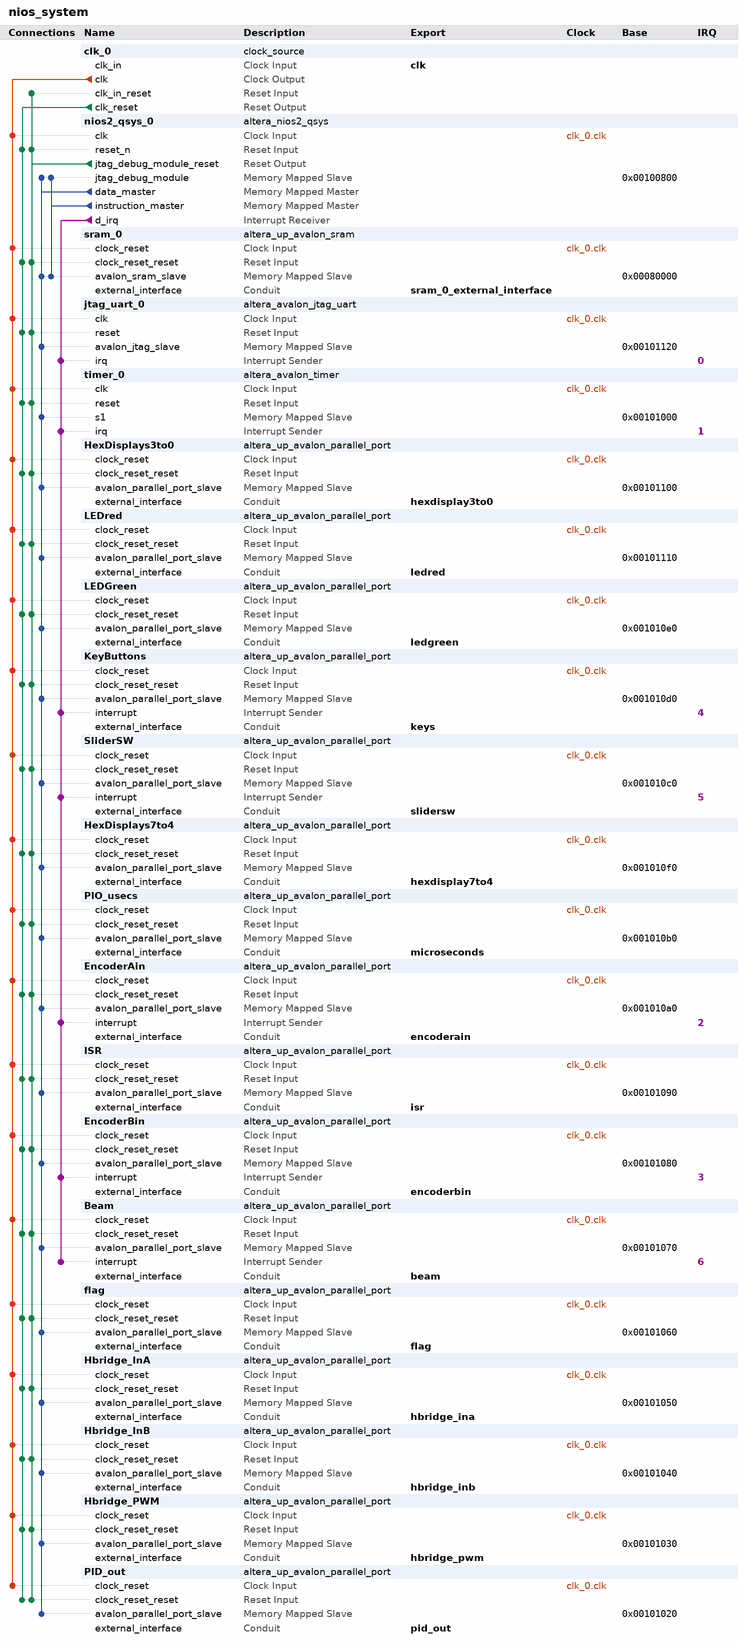
[diagram p0: system contents]
# Platform Designer (Qsys) system nios_system, Cyclone II EP2C35F672C6
# Parameters at their usual value, and those the tool derives, are not listed.
package require -exact qsys 13.0
create_system nios_system
set_project_property DEVICE_FAMILY {Cyclone II}
set_project_property DEVICE EP2C35F672C6

add_instance clk_0 clock_source 13.0
set_instance_parameter_value clk_0 clockFrequency 50000000

add_instance nios2_qsys_0 altera_nios2_qsys 13.0
set_instance_parameter_value nios2_qsys_0 resetSlave sram_0.avalon_sram_slave
set_instance_parameter_value nios2_qsys_0 mmu_TLBMissExcSlave None
set_instance_parameter_value nios2_qsys_0 exceptionSlave sram_0.avalon_sram_slave
set_instance_parameter_value nios2_qsys_0 breakSlave nios2_qsys_0.jtag_debug_module
set_instance_parameter_value nios2_qsys_0 impl Small
set_instance_parameter_value nios2_qsys_0 icache_size 4096

add_instance sram_0 altera_up_avalon_sram 13.0
set_instance_parameter_value sram_0 board DE2
set_instance_parameter_value sram_0 pixel_buffer false

add_instance jtag_uart_0 altera_avalon_jtag_uart 13.0.1.99.2
set_instance_parameter_value jtag_uart_0 simInteractiveOptions NO_INTERACTIVE_WINDOWS

add_instance timer_0 altera_avalon_timer 13.0.1.99.2
set_instance_parameter_value timer_0 period 1
set_instance_parameter_value timer_0 periodUnits MSEC

add_instance HexDisplays3to0 altera_up_avalon_parallel_port 13.0
set_instance_parameter_value HexDisplays3to0 board DE2
set_instance_parameter_value HexDisplays3to0 preset {Seven Segment Displays}
set_instance_parameter_value HexDisplays3to0 capture false
set_instance_parameter_value HexDisplays3to0 edge Rising
set_instance_parameter_value HexDisplays3to0 irq false

add_instance LEDred altera_up_avalon_parallel_port 13.0
set_instance_parameter_value LEDred board DE2
set_instance_parameter_value LEDred preset LEDs
set_instance_parameter_value LEDred leds Red
set_instance_parameter_value LEDred capture false
set_instance_parameter_value LEDred edge Rising
set_instance_parameter_value LEDred irq false

add_instance LEDGreen altera_up_avalon_parallel_port 13.0
set_instance_parameter_value LEDGreen board DE2
set_instance_parameter_value LEDGreen preset LEDs
set_instance_parameter_value LEDGreen capture false
set_instance_parameter_value LEDGreen edge Rising
set_instance_parameter_value LEDGreen irq false

add_instance KeyButtons altera_up_avalon_parallel_port 13.0
set_instance_parameter_value KeyButtons board DE2
set_instance_parameter_value KeyButtons preset Pushbuttons
set_instance_parameter_value KeyButtons capture true
set_instance_parameter_value KeyButtons edge Rising
set_instance_parameter_value KeyButtons irq true

add_instance SliderSW altera_up_avalon_parallel_port 13.0
set_instance_parameter_value SliderSW board DE2
set_instance_parameter_value SliderSW preset {Slider Switches}
set_instance_parameter_value SliderSW capture true
set_instance_parameter_value SliderSW edge Either
set_instance_parameter_value SliderSW irq true

add_instance HexDisplays7to4 altera_up_avalon_parallel_port 13.0
set_instance_parameter_value HexDisplays7to4 board DE2
set_instance_parameter_value HexDisplays7to4 preset {Seven Segment Displays}
set_instance_parameter_value HexDisplays7to4 sevensegs {7 to 4}
set_instance_parameter_value HexDisplays7to4 capture false
set_instance_parameter_value HexDisplays7to4 edge Rising
set_instance_parameter_value HexDisplays7to4 irq false

add_instance PIO_usecs altera_up_avalon_parallel_port 13.0
set_instance_parameter_value PIO_usecs board DE2
set_instance_parameter_value PIO_usecs custom_port true
set_instance_parameter_value PIO_usecs preset Pushbuttons
set_instance_parameter_value PIO_usecs capture true
set_instance_parameter_value PIO_usecs edge Rising
set_instance_parameter_value PIO_usecs irq false

add_instance EncoderAin altera_up_avalon_parallel_port 13.0
set_instance_parameter_value EncoderAin board DE2
set_instance_parameter_value EncoderAin custom_port true
set_instance_parameter_value EncoderAin preset Pushbuttons
set_instance_parameter_value EncoderAin capture true
set_instance_parameter_value EncoderAin edge Either
set_instance_parameter_value EncoderAin irq true

add_instance ISR altera_up_avalon_parallel_port 13.0
set_instance_parameter_value ISR board DE2
set_instance_parameter_value ISR custom_port true
set_instance_parameter_value ISR preset Pushbuttons
set_instance_parameter_value ISR capture false
set_instance_parameter_value ISR edge Rising
set_instance_parameter_value ISR irq false

add_instance EncoderBin altera_up_avalon_parallel_port 13.0
set_instance_parameter_value EncoderBin board DE2
set_instance_parameter_value EncoderBin custom_port true
set_instance_parameter_value EncoderBin preset Pushbuttons
set_instance_parameter_value EncoderBin capture true
set_instance_parameter_value EncoderBin edge Either
set_instance_parameter_value EncoderBin irq true

add_instance Beam altera_up_avalon_parallel_port 13.0
set_instance_parameter_value Beam board DE2
set_instance_parameter_value Beam custom_port true
set_instance_parameter_value Beam preset Pushbuttons
set_instance_parameter_value Beam capture true
set_instance_parameter_value Beam edge Either
set_instance_parameter_value Beam irq true

add_instance flag altera_up_avalon_parallel_port 13.0
set_instance_parameter_value flag board DE2
set_instance_parameter_value flag custom_port true
set_instance_parameter_value flag preset Pushbuttons
set_instance_parameter_value flag capture true
set_instance_parameter_value flag edge Either
set_instance_parameter_value flag irq true

add_instance Hbridge_InA altera_up_avalon_parallel_port 13.0
set_instance_parameter_value Hbridge_InA board DE2
set_instance_parameter_value Hbridge_InA custom_port true
set_instance_parameter_value Hbridge_InA preset Pushbuttons
set_instance_parameter_value Hbridge_InA capture false
set_instance_parameter_value Hbridge_InA edge Rising
set_instance_parameter_value Hbridge_InA irq false

add_instance Hbridge_InB altera_up_avalon_parallel_port 13.0
set_instance_parameter_value Hbridge_InB board DE2
set_instance_parameter_value Hbridge_InB custom_port true
set_instance_parameter_value Hbridge_InB preset Pushbuttons
set_instance_parameter_value Hbridge_InB capture false
set_instance_parameter_value Hbridge_InB edge Rising
set_instance_parameter_value Hbridge_InB irq false

add_instance Hbridge_PWM altera_up_avalon_parallel_port 13.0
set_instance_parameter_value Hbridge_PWM board DE2
set_instance_parameter_value Hbridge_PWM custom_port true
set_instance_parameter_value Hbridge_PWM preset Pushbuttons
set_instance_parameter_value Hbridge_PWM capture false
set_instance_parameter_value Hbridge_PWM edge Rising
set_instance_parameter_value Hbridge_PWM irq false

add_instance PID_out altera_up_avalon_parallel_port 13.0
set_instance_parameter_value PID_out board DE2
set_instance_parameter_value PID_out custom_port true
set_instance_parameter_value PID_out preset Pushbuttons
set_instance_parameter_value PID_out capture true
set_instance_parameter_value PID_out edge Either
set_instance_parameter_value PID_out irq true

# connections
add_connection clk_0.clk Beam.clock_reset clock
add_connection clk_0.clk EncoderAin.clock_reset clock
add_connection clk_0.clk EncoderBin.clock_reset clock
add_connection clk_0.clk flag.clock_reset clock
add_connection clk_0.clk Hbridge_InA.clock_reset clock
add_connection clk_0.clk Hbridge_InB.clock_reset clock
add_connection clk_0.clk Hbridge_PWM.clock_reset clock
add_connection clk_0.clk HexDisplays3to0.clock_reset clock
add_connection clk_0.clk HexDisplays7to4.clock_reset clock
add_connection clk_0.clk ISR.clock_reset clock
add_connection clk_0.clk jtag_uart_0.clk clock
add_connection clk_0.clk KeyButtons.clock_reset clock
add_connection clk_0.clk LEDGreen.clock_reset clock
add_connection clk_0.clk LEDred.clock_reset clock
add_connection clk_0.clk nios2_qsys_0.clk clock
add_connection clk_0.clk PID_out.clock_reset clock
add_connection clk_0.clk PIO_usecs.clock_reset clock
add_connection clk_0.clk SliderSW.clock_reset clock
add_connection clk_0.clk sram_0.clock_reset clock
add_connection clk_0.clk timer_0.clk clock
add_connection clk_0.clk_reset Beam.clock_reset_reset reset
add_connection clk_0.clk_reset EncoderAin.clock_reset_reset reset
add_connection clk_0.clk_reset EncoderBin.clock_reset_reset reset
add_connection clk_0.clk_reset flag.clock_reset_reset reset
add_connection clk_0.clk_reset Hbridge_InA.clock_reset_reset reset
add_connection clk_0.clk_reset Hbridge_InB.clock_reset_reset reset
add_connection clk_0.clk_reset Hbridge_PWM.clock_reset_reset reset
add_connection clk_0.clk_reset HexDisplays3to0.clock_reset_reset reset
add_connection clk_0.clk_reset HexDisplays7to4.clock_reset_reset reset
add_connection clk_0.clk_reset ISR.clock_reset_reset reset
add_connection clk_0.clk_reset jtag_uart_0.reset reset
add_connection clk_0.clk_reset KeyButtons.clock_reset_reset reset
add_connection clk_0.clk_reset LEDGreen.clock_reset_reset reset
add_connection clk_0.clk_reset LEDred.clock_reset_reset reset
add_connection clk_0.clk_reset nios2_qsys_0.reset_n reset
add_connection clk_0.clk_reset PID_out.clock_reset_reset reset
add_connection clk_0.clk_reset PIO_usecs.clock_reset_reset reset
add_connection clk_0.clk_reset SliderSW.clock_reset_reset reset
add_connection clk_0.clk_reset sram_0.clock_reset_reset reset
add_connection clk_0.clk_reset timer_0.reset reset
add_connection nios2_qsys_0.jtag_debug_module_reset Beam.clock_reset_reset reset
add_connection nios2_qsys_0.jtag_debug_module_reset clk_0.clk_in_reset reset
add_connection nios2_qsys_0.jtag_debug_module_reset EncoderAin.clock_reset_reset reset
add_connection nios2_qsys_0.jtag_debug_module_reset EncoderBin.clock_reset_reset reset
add_connection nios2_qsys_0.jtag_debug_module_reset flag.clock_reset_reset reset
add_connection nios2_qsys_0.jtag_debug_module_reset Hbridge_InA.clock_reset_reset reset
add_connection nios2_qsys_0.jtag_debug_module_reset Hbridge_InB.clock_reset_reset reset
add_connection nios2_qsys_0.jtag_debug_module_reset Hbridge_PWM.clock_reset_reset reset
add_connection nios2_qsys_0.jtag_debug_module_reset HexDisplays3to0.clock_reset_reset reset
add_connection nios2_qsys_0.jtag_debug_module_reset HexDisplays7to4.clock_reset_reset reset
add_connection nios2_qsys_0.jtag_debug_module_reset ISR.clock_reset_reset reset
add_connection nios2_qsys_0.jtag_debug_module_reset jtag_uart_0.reset reset
add_connection nios2_qsys_0.jtag_debug_module_reset KeyButtons.clock_reset_reset reset
add_connection nios2_qsys_0.jtag_debug_module_reset LEDGreen.clock_reset_reset reset
add_connection nios2_qsys_0.jtag_debug_module_reset LEDred.clock_reset_reset reset
add_connection nios2_qsys_0.jtag_debug_module_reset nios2_qsys_0.reset_n reset
add_connection nios2_qsys_0.jtag_debug_module_reset PID_out.clock_reset_reset reset
add_connection nios2_qsys_0.jtag_debug_module_reset PIO_usecs.clock_reset_reset reset
add_connection nios2_qsys_0.jtag_debug_module_reset SliderSW.clock_reset_reset reset
add_connection nios2_qsys_0.jtag_debug_module_reset sram_0.clock_reset_reset reset
add_connection nios2_qsys_0.jtag_debug_module_reset timer_0.reset reset
add_connection nios2_qsys_0.data_master Beam.avalon_parallel_port_slave avalon
set_connection_parameter_value nios2_qsys_0.data_master/Beam.avalon_parallel_port_slave baseAddress 0x00101070
add_connection nios2_qsys_0.data_master EncoderAin.avalon_parallel_port_slave avalon
set_connection_parameter_value nios2_qsys_0.data_master/EncoderAin.avalon_parallel_port_slave baseAddress 0x001010a0
add_connection nios2_qsys_0.data_master EncoderBin.avalon_parallel_port_slave avalon
set_connection_parameter_value nios2_qsys_0.data_master/EncoderBin.avalon_parallel_port_slave baseAddress 0x00101080
add_connection nios2_qsys_0.data_master flag.avalon_parallel_port_slave avalon
set_connection_parameter_value nios2_qsys_0.data_master/flag.avalon_parallel_port_slave baseAddress 0x00101060
add_connection nios2_qsys_0.data_master Hbridge_InA.avalon_parallel_port_slave avalon
set_connection_parameter_value nios2_qsys_0.data_master/Hbridge_InA.avalon_parallel_port_slave baseAddress 0x00101050
add_connection nios2_qsys_0.data_master Hbridge_InB.avalon_parallel_port_slave avalon
set_connection_parameter_value nios2_qsys_0.data_master/Hbridge_InB.avalon_parallel_port_slave baseAddress 0x00101040
add_connection nios2_qsys_0.data_master Hbridge_PWM.avalon_parallel_port_slave avalon
set_connection_parameter_value nios2_qsys_0.data_master/Hbridge_PWM.avalon_parallel_port_slave baseAddress 0x00101030
add_connection nios2_qsys_0.data_master HexDisplays3to0.avalon_parallel_port_slave avalon
set_connection_parameter_value nios2_qsys_0.data_master/HexDisplays3to0.avalon_parallel_port_slave baseAddress 0x00101100
add_connection nios2_qsys_0.data_master HexDisplays7to4.avalon_parallel_port_slave avalon
set_connection_parameter_value nios2_qsys_0.data_master/HexDisplays7to4.avalon_parallel_port_slave baseAddress 0x001010f0
add_connection nios2_qsys_0.data_master ISR.avalon_parallel_port_slave avalon
set_connection_parameter_value nios2_qsys_0.data_master/ISR.avalon_parallel_port_slave baseAddress 0x00101090
add_connection nios2_qsys_0.data_master jtag_uart_0.avalon_jtag_slave avalon
set_connection_parameter_value nios2_qsys_0.data_master/jtag_uart_0.avalon_jtag_slave baseAddress 0x00101120
add_connection nios2_qsys_0.data_master KeyButtons.avalon_parallel_port_slave avalon
set_connection_parameter_value nios2_qsys_0.data_master/KeyButtons.avalon_parallel_port_slave baseAddress 0x001010d0
add_connection nios2_qsys_0.data_master LEDGreen.avalon_parallel_port_slave avalon
set_connection_parameter_value nios2_qsys_0.data_master/LEDGreen.avalon_parallel_port_slave baseAddress 0x001010e0
add_connection nios2_qsys_0.data_master LEDred.avalon_parallel_port_slave avalon
set_connection_parameter_value nios2_qsys_0.data_master/LEDred.avalon_parallel_port_slave baseAddress 0x00101110
add_connection nios2_qsys_0.data_master nios2_qsys_0.jtag_debug_module avalon
set_connection_parameter_value nios2_qsys_0.data_master/nios2_qsys_0.jtag_debug_module baseAddress 0x00100800
add_connection nios2_qsys_0.data_master PID_out.avalon_parallel_port_slave avalon
set_connection_parameter_value nios2_qsys_0.data_master/PID_out.avalon_parallel_port_slave baseAddress 0x00101020
add_connection nios2_qsys_0.data_master PIO_usecs.avalon_parallel_port_slave avalon
set_connection_parameter_value nios2_qsys_0.data_master/PIO_usecs.avalon_parallel_port_slave baseAddress 0x001010b0
add_connection nios2_qsys_0.data_master SliderSW.avalon_parallel_port_slave avalon
set_connection_parameter_value nios2_qsys_0.data_master/SliderSW.avalon_parallel_port_slave baseAddress 0x001010c0
add_connection nios2_qsys_0.data_master sram_0.avalon_sram_slave avalon
set_connection_parameter_value nios2_qsys_0.data_master/sram_0.avalon_sram_slave baseAddress 0x00080000
add_connection nios2_qsys_0.data_master timer_0.s1 avalon
set_connection_parameter_value nios2_qsys_0.data_master/timer_0.s1 baseAddress 0x00101000
add_connection nios2_qsys_0.instruction_master nios2_qsys_0.jtag_debug_module avalon
set_connection_parameter_value nios2_qsys_0.instruction_master/nios2_qsys_0.jtag_debug_module baseAddress 0x00100800
add_connection nios2_qsys_0.instruction_master sram_0.avalon_sram_slave avalon
set_connection_parameter_value nios2_qsys_0.instruction_master/sram_0.avalon_sram_slave baseAddress 0x00080000
add_connection nios2_qsys_0.d_irq Beam.interrupt interrupt
set_connection_parameter_value nios2_qsys_0.d_irq/Beam.interrupt irqNumber 6
add_connection nios2_qsys_0.d_irq EncoderAin.interrupt interrupt
set_connection_parameter_value nios2_qsys_0.d_irq/EncoderAin.interrupt irqNumber 2
add_connection nios2_qsys_0.d_irq EncoderBin.interrupt interrupt
set_connection_parameter_value nios2_qsys_0.d_irq/EncoderBin.interrupt irqNumber 3
add_connection nios2_qsys_0.d_irq jtag_uart_0.irq interrupt
set_connection_parameter_value nios2_qsys_0.d_irq/jtag_uart_0.irq irqNumber 0
add_connection nios2_qsys_0.d_irq KeyButtons.interrupt interrupt
set_connection_parameter_value nios2_qsys_0.d_irq/KeyButtons.interrupt irqNumber 4
add_connection nios2_qsys_0.d_irq SliderSW.interrupt interrupt
set_connection_parameter_value nios2_qsys_0.d_irq/SliderSW.interrupt irqNumber 5
add_connection nios2_qsys_0.d_irq timer_0.irq interrupt
set_connection_parameter_value nios2_qsys_0.d_irq/timer_0.irq irqNumber 1

# exported interfaces
add_interface clk clock sink
set_interface_property clk EXPORT_OF clk_0.clk_in
add_interface sram_0_external_interface conduit end
set_interface_property sram_0_external_interface EXPORT_OF sram_0.external_interface
add_interface slidersw conduit end
set_interface_property slidersw EXPORT_OF SliderSW.external_interface
add_interface hexdisplay3to0 conduit end
set_interface_property hexdisplay3to0 EXPORT_OF HexDisplays3to0.external_interface
add_interface hexdisplay7to4 conduit end
set_interface_property hexdisplay7to4 EXPORT_OF HexDisplays7to4.external_interface
add_interface keys conduit end
set_interface_property keys EXPORT_OF KeyButtons.external_interface
add_interface ledgreen conduit end
set_interface_property ledgreen EXPORT_OF LEDGreen.external_interface
add_interface ledred conduit end
set_interface_property ledred EXPORT_OF LEDred.external_interface
add_interface microseconds conduit end
set_interface_property microseconds EXPORT_OF PIO_usecs.external_interface
add_interface encoderain conduit end
set_interface_property encoderain EXPORT_OF EncoderAin.external_interface
add_interface isr conduit end
set_interface_property isr EXPORT_OF ISR.external_interface
add_interface encoderbin conduit end
set_interface_property encoderbin EXPORT_OF EncoderBin.external_interface
add_interface beam conduit end
set_interface_property beam EXPORT_OF Beam.external_interface
add_interface flag conduit end
set_interface_property flag EXPORT_OF flag.external_interface
add_interface hbridge_ina conduit end
set_interface_property hbridge_ina EXPORT_OF Hbridge_InA.external_interface
add_interface hbridge_inb conduit end
set_interface_property hbridge_inb EXPORT_OF Hbridge_InB.external_interface
add_interface hbridge_pwm conduit end
set_interface_property hbridge_pwm EXPORT_OF Hbridge_PWM.external_interface
add_interface pid_out conduit end
set_interface_property pid_out EXPORT_OF PID_out.external_interface

set_interconnect_requirement {$system} qsys_mm.clockCrossingAdapter HANDSHAKE
set_interconnect_requirement {$system} qsys_mm.maxAdditionalLatency 1

save_system nios_system.qsys
